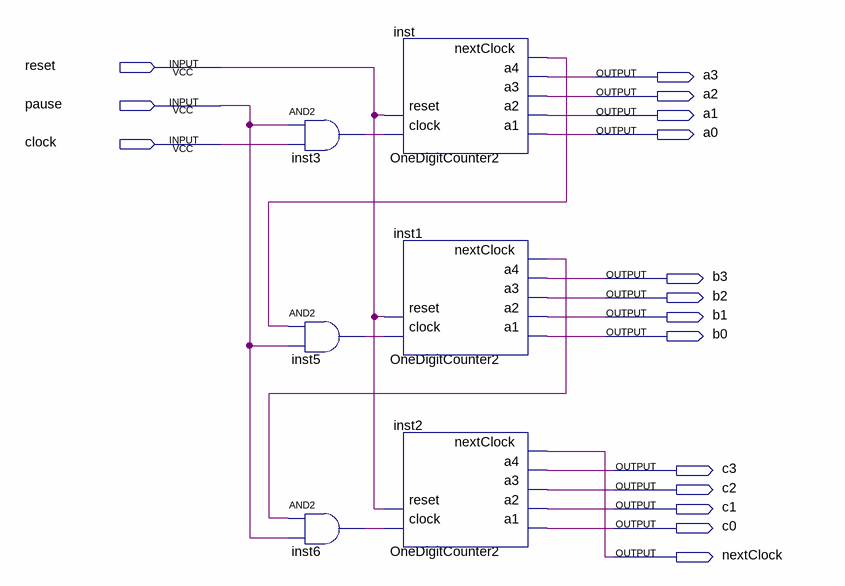
[diagram p0: schematic sheet]
// Quartus schematic cronometro.bdf as structural Verilog: 6 symbols, 16 pins
module cronometro (
  input  reset,
  input  pause,
  input  clock,
  output a3,
  output a2,
  output a1,
  output a0,
  output b3,
  output b2,
  output b1,
  output b0,
  output c3,
  output c2,
  output c1,
  output c0,
  output nextClock
);

  wire inst1_nextclock, inst3_out, inst5_out, inst6_out, inst_nextclock;

  and inst3 (inst3_out, pause, clock);
  and inst5 (inst5_out, inst_nextclock, pause);
  and inst6 (inst6_out, inst1_nextclock, pause);
  OneDigitCounter2 inst (
    .clock(inst3_out), .reset(reset), .a1(a0), .a2(a1), .a3(a2), .a4(a3), .nextClock(inst_nextclock));
  OneDigitCounter2 inst1 (
    .clock(inst5_out), .reset(reset), .a1(b0), .a2(b1), .a3(b2), .a4(b3), .nextClock(inst1_nextclock));
  OneDigitCounter2 inst2 (.clock(inst6_out), .reset(reset), .a1(c0), .a2(c1), .a3(c2), .a4(c3), .nextClock(nextClock));
endmodule
